# EAGLE design currentsense (EAGLE 9.5.2)
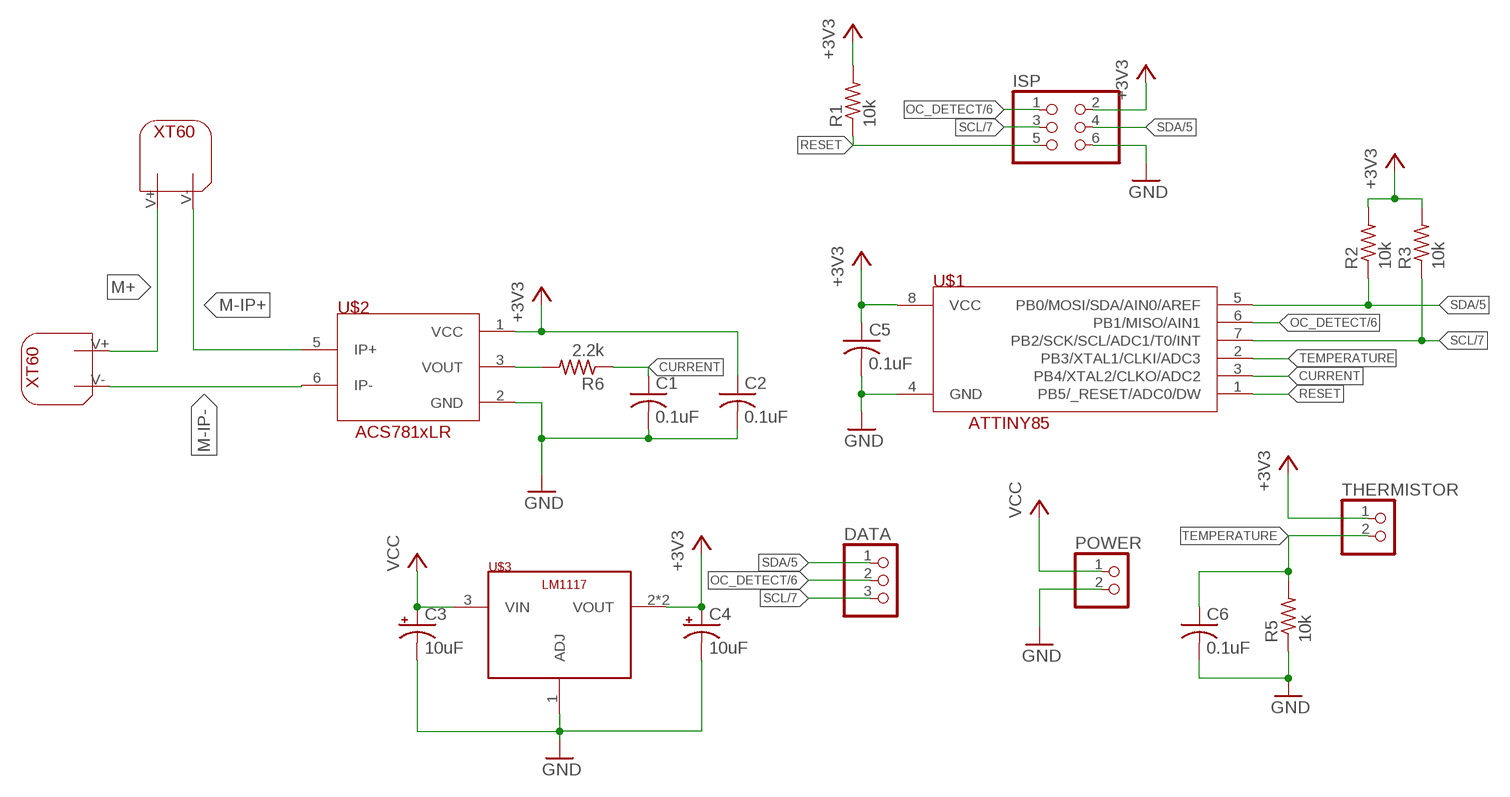
[diagram p0: schematic, sheet 1]

## Parts
C1  0.1uF  C-USC0805  [C0805]
C2  0.1uF  C-USC0805  [C0805]
C3  10uF  CPOL-USE2.5-6  [E2,5-6]
C4  10uF  CPOL-USE2.5-6  [E2,5-6]
C5  0.1uF  C-USC0805  [C0805]
C6  0.1uF  C-USC0805  [C0805]
DATA  PINHD-1X3  [1X03]
ISP  PINHD-2X3  [2X03]
POWER  PINHD-1X2  [1X02]
R1  10k  R-US_M0805  [M0805]
R2  10k  R-US_M0805  [M0805]
R3  10k  R-US_M0805  [M0805]
R5  10k  R-US_M0805  [M0805]
R6  2.2k  R-US_M0805  [M0805]
THERMISTOR  PINHD-1X2  [1X02]
U$1  ATTINY85V-10SUR  [SOIC8]
U$2  ACS781LLRTR-050B-T_M  [7-PSOF-EXTENDED]
U$3  LM1117  [SOT223]
U$4  XT60-RA  [XT60_RA]
U$5  XT60-RA  [XT60_RA]

## Nets
+3V3: C2.1 C4.+ C5.1 ISP.2 R1.2 R2.2 R3.2 THERMISTOR.1 U$1.8(VCC) U$2.1(VCC) U$3.2(VOUT) U$3.4(VOUT)
CURRENT: C1.1 R6.1 U$1.3(PB4/XTAL2/CLKO/ADC2)
GND: C1.2 C2.2 C3.- C4.- C5.2 C6.2 ISP.6 POWER.2 R5.1 U$1.4(GND) U$2.2(GND) U$3.1(ADJ)
M+ [hicurrent]: U$4.V+ U$5.V+
M-IP+ [hicurrent]: U$2.5(IP+) U$4.V-
M-IP- [hicurrent]: U$2.6(IP-) U$5.V-
N$2: R6.2 U$2.3(VOUT)
OC_DETECT/6: DATA.2 ISP.1 U$1.6(PB1/MISO/AIN1)
RESET: ISP.5 R1.1 U$1.1(PB5/_RESET/ADC0/DW)
SCL/7: DATA.3 ISP.3 R3.1 U$1.7(PB2/SCK/SCL/ADC1/T0/INT)
SDA/5: DATA.1 ISP.4 R2.1 U$1.5(PB0/MOSI/SDA/AIN0/AREF)
TEMPERATURE: C6.1 R5.2 THERMISTOR.2 U$1.2(PB3/XTAL1/CLKI/ADC3)
VCC: C3.+ POWER.1 U$3.3(VIN)

## Library data of the parts
C1 C2 C5 C6 = rcl:C-US: CAPACITOR, American symbol; SPICEPREFIX: C
C3 C4 = rcl:CPOL-US: POLARIZED CAPACITOR, American symbol; SPICEPREFIX: C
DATA = pinhead:PINHD-1X3: PIN HEADER
ISP = pinhead:PINHD-2X3: PIN HEADER
POWER THERMISTOR = pinhead:PINHD-1X2: PIN HEADER
R1-R3 R5 R6 = rcl:R-US_: RESISTOR, American symbol; SPICEPREFIX: R
U$1 = currentlim:ATTINY85
U$2 = currentlim:ACS781
U$3 = currentlim:LM1117
U$4 U$5 = XT Connectors:XT60-RA: XT-60 PW - Female Right Angle Connector Link: https://www.aliexpress.com/item/32967095856.html?spm=a2g0o.detail.1000013.7.4264231fM1HDeO&gps-id=pcDetailBottomMoreThisSeller&scm=1007.13339.146401.0&scm_id=1007.13339.146401.0&scm-url=1007.13339.146401.0&pvid=e3c83db9-5f76-47a4-89a0-cd13f27bd814

## Net classes
1 hicurrent: clearance 0.762 mm

## Board
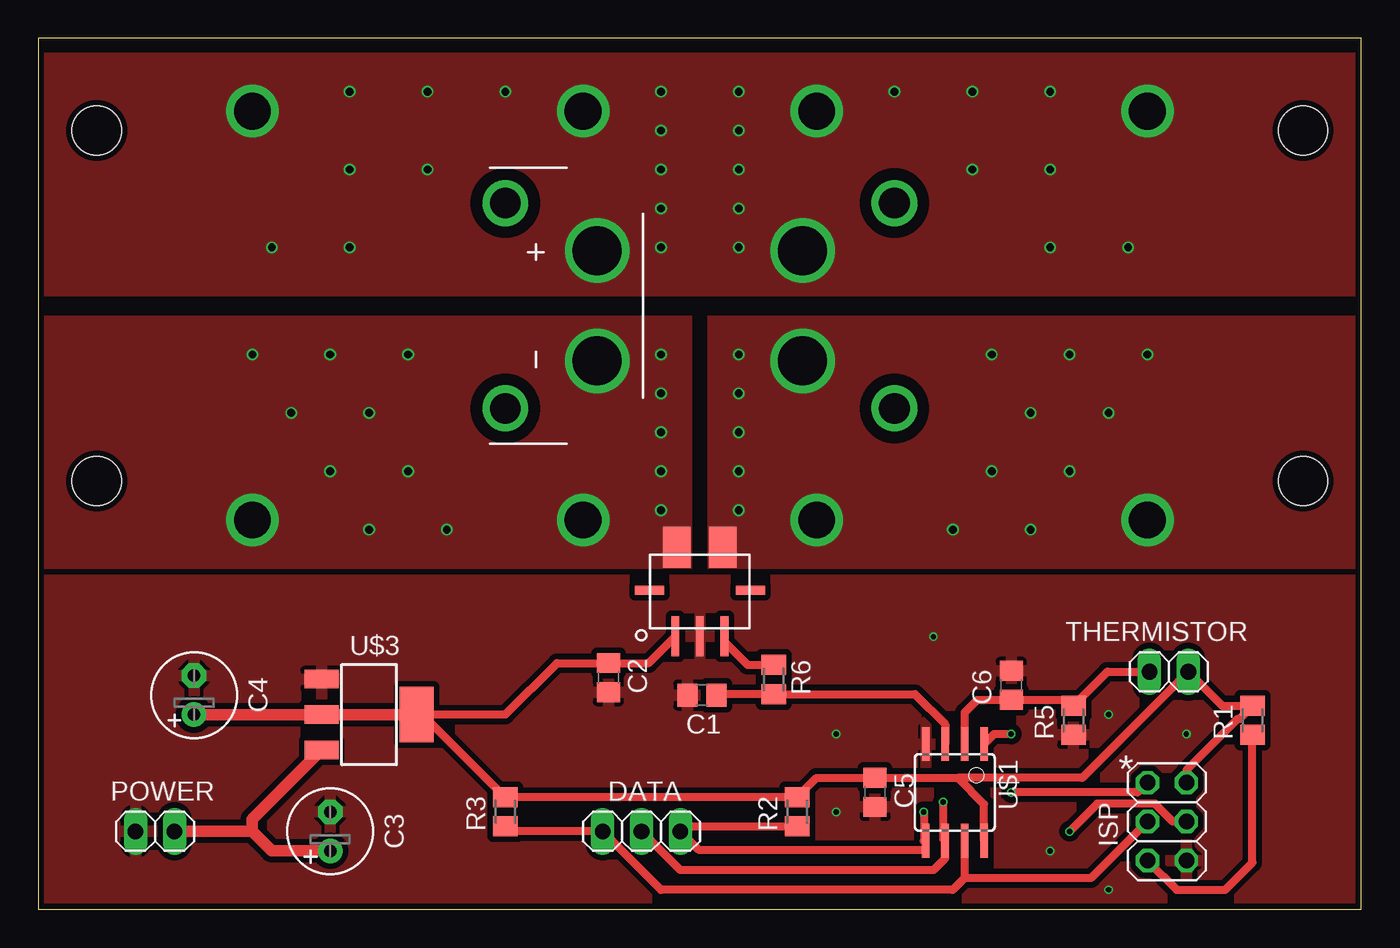
[diagram p1: board, top side]
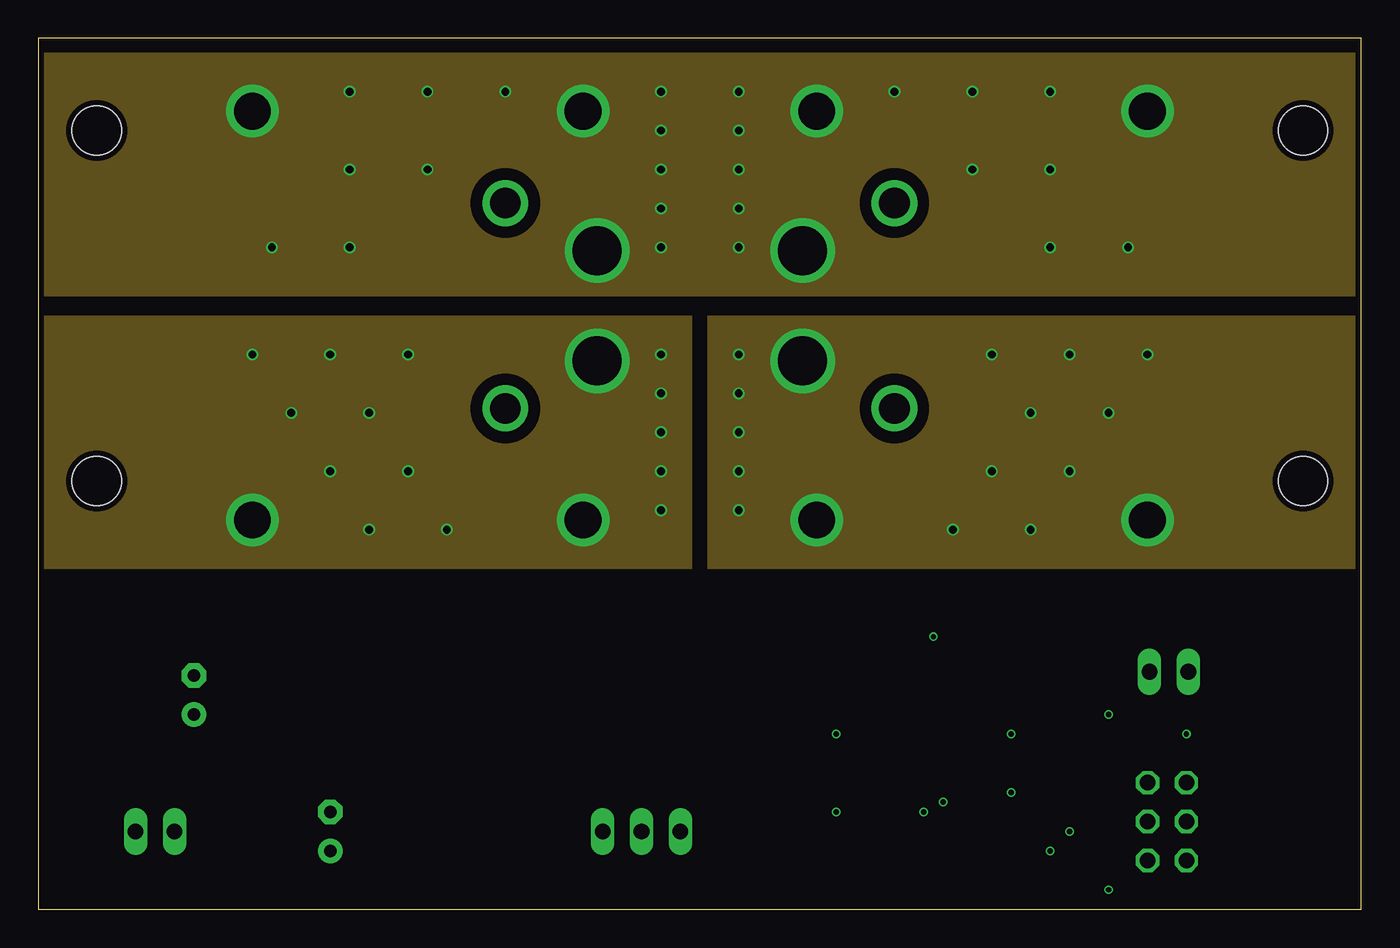
[diagram p2: board, inner layer Route2]
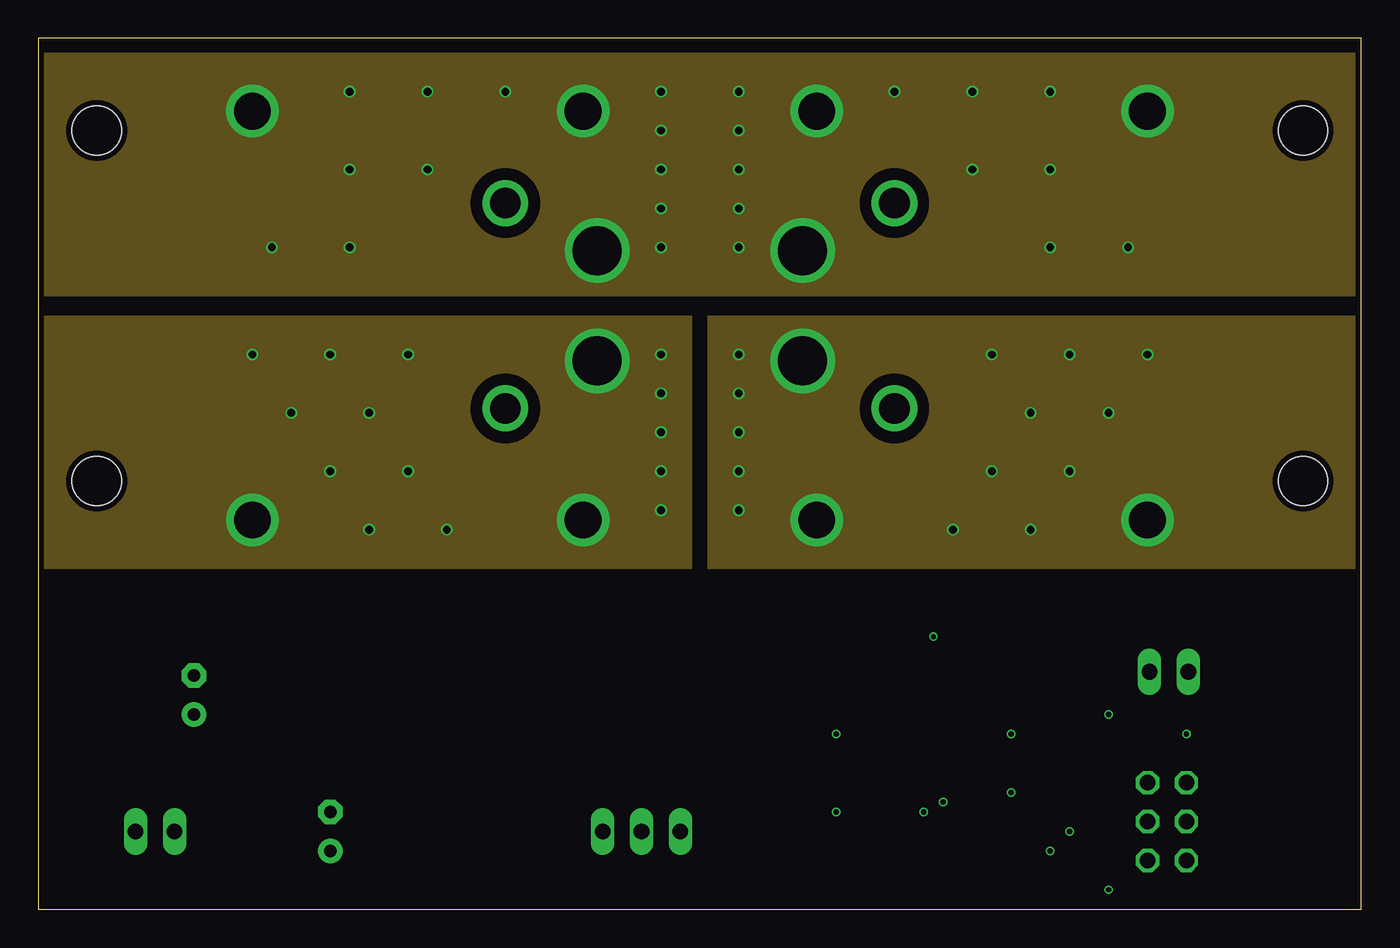
[diagram p3: board, inner layer Route15]
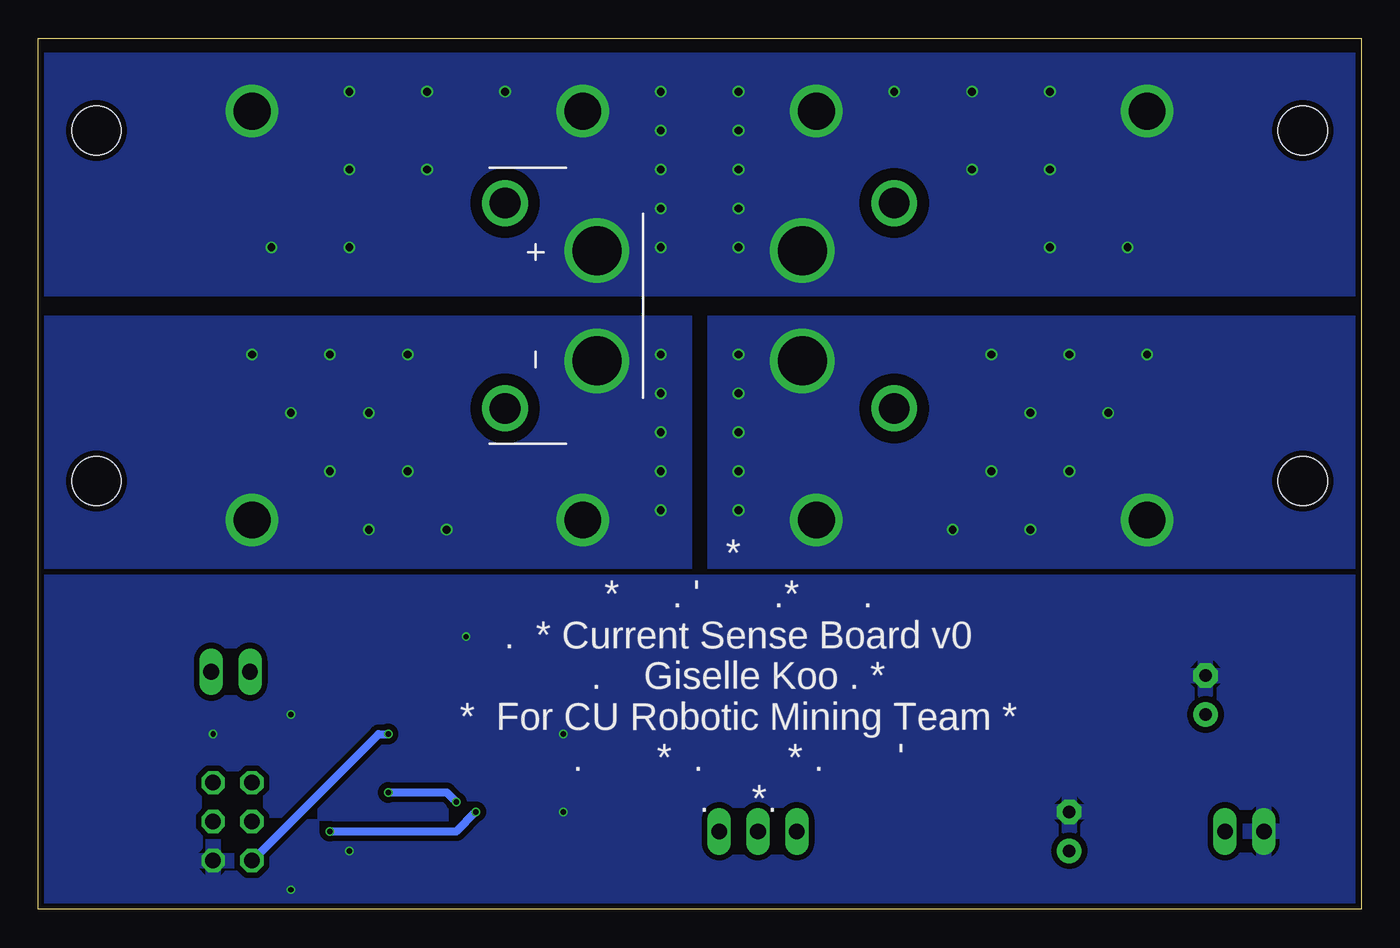
[diagram p4: board, bottom side, seen from below]

Size 86.34 x 56.82 mm. Coordinates in mm from the lower left corner, seen from the top.
Outline: 0,0 86.34,0 86.34,56.82 0,56.82 0,0
Copper layers (1*2*15*16): Top 0.035559375mm / dielectric 0.22098125mm / Route2 0.035559375mm / dielectric 39mil / Route15 0.035559375mm / dielectric 0.22098125mm / Bottom 0.035559375mm
Design rules "advanced-circuits-4layer *": minimum track width 5mil, minimum drill 10mil, track to track 5mil, track to pad 5mil, pad to pad 5mil, via to via 5mil, smd to smd 5mil, copper to edge 15mil, drill to drill 6mil, minimum pad ring 4mil, minimum via ring 4mil, stop-mask expansion 2.5mil, vias tented up to drill 14mil, thermal gap 10mil
Holes 3.2 mm at 3.81,27.94 3.81,50.8 82.55,50.8 82.55,27.94
tKeepout: area 33.1,49.6 to 38.1,54.6; area 48.3,49.6 to 53.3,54.6; area 33.1,22.9 to 38.1,27.9; area 48.3,22.9 to 53.3,27.9; area 11.5,22.9 to 16.5,27.9; area 69.9,22.9 to 74.9,27.9; area 11.5,49.6 to 16.5,54.6; area 69.9,49.6 to 74.9,54.6

### Footprints (pad centres in the part's own frame; a part is rotated, then mirrored left to right if it is on the bottom)
C0805 = smd 1.3 x 1.5: 1 -0.95,0; 2 0.95,0
E2,5-6 = drill 0.813 pad 1.6: + -1.27,0 | drill 0.813 pad 1.6 octagon: - 1.27,0
1X03 = drill 1.016 long: 1 -2.54,0; 2 0,0; 3 2.54,0
2X03 = drill 1.016 octagon: 1 -2.54,-1.27; 2 -2.54,1.27; 3 0,-1.27; 4 0,1.27; 5 2.54,-1.27; 6 2.54,1.27
1X02 = drill 1.016 long: 1 -1.27,0; 2 1.27,0
M0805 = smd 1.3 x 1.6: 1 -0.95,0; 2 0.95,0
SOIC8 = smd 0.5 x 2.2: 1 -1.905,-3.154; 2 -0.645,-3.154; 3 0.625,-3.154; 4 1.895,-3.154; 5 1.905,3.154; 6 0.635,3.154; 7 -0.635,3.154; 8 -1.905,3.154
7-PSOF-EXTENDED = smd 0.5 x 2.6: 1 -1.6,-0.6; 2 0,-0.6; 3 1.6,-0.6 | smd 1.9 x 0.6: 4 3.3,2.4; 7 -3.3,2.4 | smd 1.8 x 2.7: 5 1.5,5.2; 6 -1.5,5.2
SOT223 = smd 1.219 x 2.235: 1 -2.311,-3.099; 2 0,-3.099; 3 2.311,-3.099 | smd 3.6 x 2.2: 4 0,3.099
XT60_RA = drill 2: NC -6.7,0; NC2 6.7,0 | drill 3.2: V+ -3.6,6; V- 3.6,6

### Placement (x,y rotation side)
C1  43.31,13.97 180 top
C2  37.21,15.11 270 top
C3  19.05,5.08 90 top
C4  10.16,13.97 90 top
C5  54.61,7.62 270 top
C6  63.5,14.61 90 top
DATA  39.37,5.08 180 top
ISP  73.66,5.71 270 top
POWER  7.62,5.08 180 top
R1  79.25,12.32 90 top
R2  49.53,6.35 90 top
R3  30.48,6.35 90 top
R5  67.56,12.32 90 top
R6  48.01,14.99 90 top
THERMISTOR  73.79,15.49 180 top
U$1  59.82,7.62 180 top
U$2  43.18,18.41 0 top
U$3  21.59,12.7 270 top
U$4  55.88,39.37 270 bottom
U$5  30.48,39.37 270 top

### Tracks (layer width: path | path; a pad name or v marks a point on that pad's centre or on a via)
+3V3
  Top 0.508: U$1.8 61.72,6.86 60.01,8.57 | 25.08,12.7 R3.2 R2.2 50.8,8.57 C5.1 60.01,8.57 | 25.08,12.7 30.48,12.7 33.84,16.06 C2.1 39.83,16.06 U$2.1 | 25.08,12.7 U$3.4 | ISP.2 74.93,9.08 78.28,12.43 78.4,12.43 R1.2 77.28,13.27 THERMISTOR.1 68.13,8.57 60.96,8.57 60.01,8.57
  Top 0.762: U$3.4 U$3.2 C4.+
CURRENT
  Top 0.508: C1.1 44.32,14.04 R6.1 57.22,14.04 59.19,12.06 U$1.3
GND  (via drill 0.35)
  other vias: 52.07,6.35 66.04,3.81 69.85,1.27 58.42,17.78 74.93,11.43 69.85,12.7 52.07,11.43
  pour Top (isolate 0.381, rank 2): 0,57.15 0,0 86.36,0 86.36,57.15
  pour Bottom (isolate 0.381, rank 2): 86.36,57.15 86.36,0 0,0 0,57.15
M+  (via drill 0.51, 2.4)
  other vias: 35.56,52.07 50.8,52.07 13.97,52.07 72.39,52.07 40.64,53.34 45.72,53.34 45.72,50.8 45.72,48.26 45.72,45.72 45.72,43.18 40.64,50.8 40.64,48.26 40.64,45.72 40.64,43.18 66.04,53.34 60.96,53.34 55.88,53.34 60.96,48.26 66.04,48.26 66.04,43.18 71.12,43.18 20.32,53.34 25.4,53.34 30.48,53.34 25.4,48.26 20.32,48.26 20.32,43.18 15.24,43.18
  pour Top (no thermals): 86.36,55.88 86.36,40.01 0,40.01 0,55.88
  pour Bottom (no thermals): 0,55.88 0,40.01 86.36,40.01 86.36,55.88
  pour Route15 (no thermals): 0,55.88 0,40.01 86.36,40.01 86.36,55.88
  pour Route2 (no thermals): 0,55.88 0,40.01 86.36,40.01 86.36,55.88
M-IP+  (via drill 0.51, 2.4)
  other vias: 50.8,25.4 72.39,25.4 45.72,36.2 45.72,33.66 45.72,31.11 45.72,28.57 45.72,26.04 72.39,36.2 67.31,36.2 62.23,36.2 64.77,32.38 69.85,32.38 67.31,28.57 62.23,28.57 64.77,24.77 59.69,24.77
  pour Top (no thermals): 86.36,38.73 43.69,38.73 43.69,22.23 86.36,22.23
  pour Bottom (no thermals): 86.36,38.73 43.69,38.73 43.69,22.23 86.36,22.23
  pour Route15 (no thermals): 86.36,38.73 43.69,38.73 43.69,22.23 86.36,22.23
  pour Route2 (no thermals): 86.36,38.73 43.69,38.73 43.69,22.23 86.36,22.23
M-IP-  (via drill 0.51, 2.4)
  other vias: 35.56,25.4 13.97,25.4 40.64,36.2 40.64,33.66 40.64,31.11 40.64,28.57 40.64,26.04 13.97,36.2 19.05,36.2 24.13,36.2 21.59,32.38 16.51,32.38 19.05,28.57 24.13,28.57 21.59,24.77 26.67,24.77
  pour Top (no thermals): 0,38.73 42.67,38.73 42.67,22.23 0,22.23
  pour Bottom (no thermals): 0,38.73 42.67,38.73 42.67,22.23 0,22.23
  pour Route2 (no thermals): 0,38.73 42.67,38.73 42.67,22.23 0,22.23
  pour Route15 (no thermals): 0,38.73 42.67,38.73 42.67,22.23 0,22.23
N$2
  Top 0.508: U$2.3 44.78,17.45 46.29,15.94 R6.2
OC_DETECT/6  (via drill 0.35)
  Top 0.508: DATA.2 41.88,2.56 58.45,2.56 59.18,3.3 U$1.6 59.05,4.59 v59.05,6.99 | ISP.1 71.75,7.62 v63.5,7.62
  Bottom 0.508: v63.5,7.62 59.69,7.62 v59.05,6.99
RESET  (via drill 0.35)
  Top 0.508: v63.5,11.43 62.38,11.43 U$1.1 | ISP.5 74.3,1.27 77.47,1.27 79.25,3.05 R1.1
  Bottom 0.508: ISP.5 64.14,11.43 v63.5,11.43
SCL/7
  Top 0.508: U$1.7 60.45,2.03 | 60.45,2.03 59.69,1.27 40.64,1.27 DATA.3 30.8,5.08 R3.1 | ISP.3 68.71,2.03 60.45,2.03
SDA/5  (via drill 0.35)
  Top 0.508: R2.1 42.23,5.4 DATA.1 43.13,3.86 57.91,3.86 U$1.5 57.78,4.47 v57.78,6.35 | ISP.4 74.04,5.71 72.87,6.88 69.11,6.88 v67.31,5.08
  Bottom 0.508: v67.31,5.08 59.05,5.08 v57.78,6.35
TEMPERATURE
  Top 0.508: U$1.2 60.46,12.84 61.28,13.65 C6.1 67.18,13.65 R5.2 69.79,15.49 THERMISTOR.2
VCC
  Top 0.762: POWER.1 13.97,5.08 | 13.97,5.08 15.24,3.81 C3.+ | U$3.3 13.97,5.87 13.97,5.08

### Text on the board
tPlace: *
bPlace: * / * . ' .* . / . * Current Sense Board v0 / . Giselle Koo . * / * For CU Robotic Mining Team * / . * . * . ' / . *.